# EAGLE design vr01-revA (EAGLE 9.6.2)
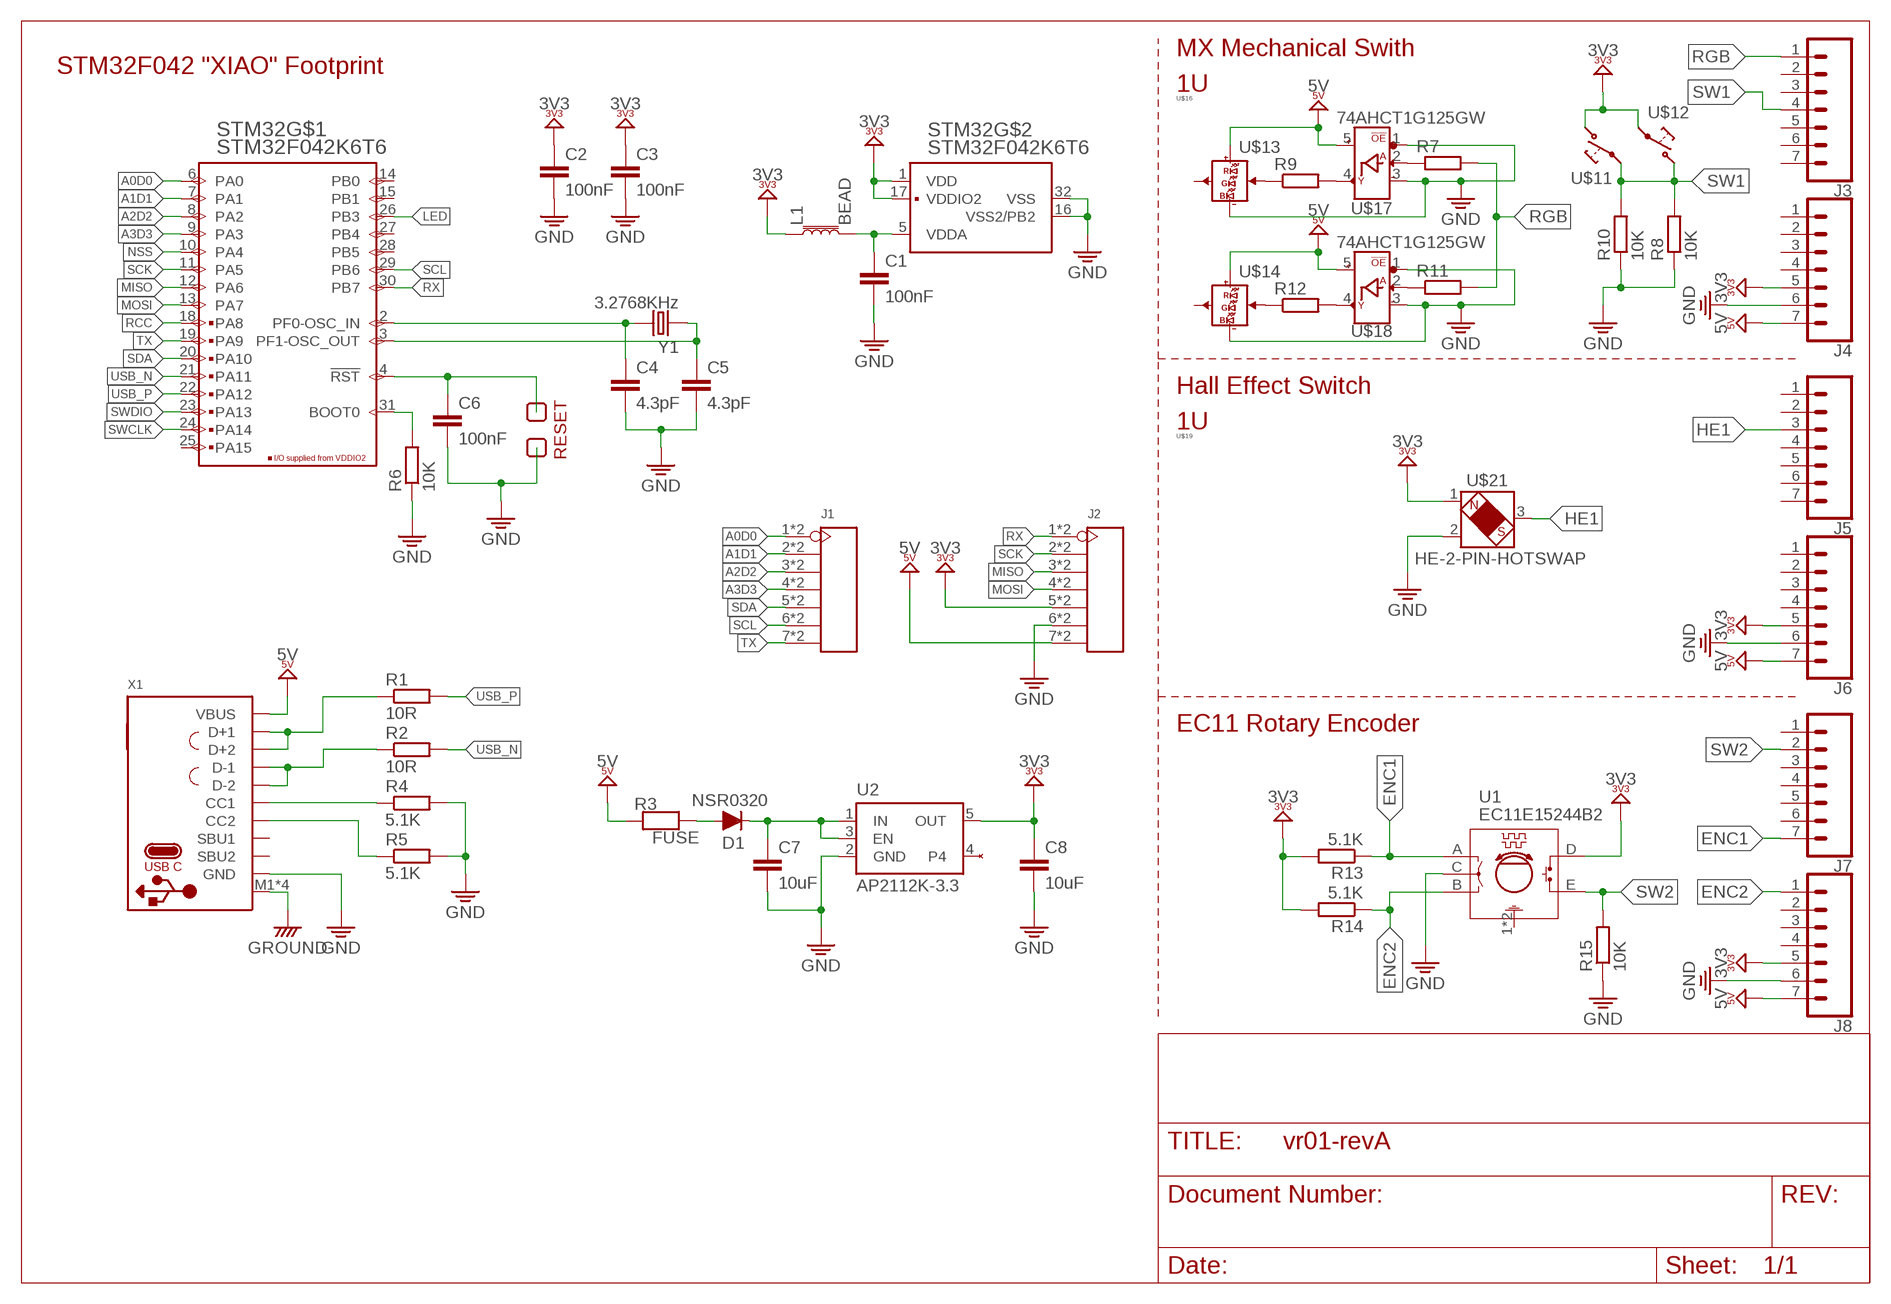
[diagram p0: schematic, sheet 1]

## Parts
C1  100nF  C-EUC0402K  [C0402K]
C2  100nF  C-EUC0402K  [C0402K]
C3  100nF  C-EUC0402K  [C0402K]
C4  4.3pF  C-EUC0402K  [C0402K]
C5  4.3pF  C-EUC0402K  [C0402K]
C6  100nF  C-EUC0402K  [C0402K]
C7  10uF  C-EUC0402K  [C0402K]
C8  10uF  C-EUC0402K  [C0402K]
D1  NSR0320  DIODESOD-323F  [SOD-323F]
J1  HEADER-7P-HALF-HOLE-2.54  [H7-HALF-HOLE-2.54]
J2  HEADER-7P-HALF-HOLE-2.54  [H7-HALF-HOLE-2.54]
J3  CONN_07  [1X07]
J4  CONN_07  [1X07]
J5  CONN_07  [1X07]
J6  CONN_07  [1X07]
J7  CONN_07  [1X07]
J8  CONN_07  [1X07]
L1  BEAD  FERRITE_BEAD  [0402]
R1  10R  R-EU_R0402  [R0402]
R2  10R  R-EU_R0402  [R0402]
R3  FUSE  RESISTOR0805_NOOUTLINE  [0805-NO]
R4  5.1K  R-EU_R0402  [R0402]
R5  5.1K  R-EU_R0402  [R0402]
R6  10K  R-EU_R0402  [R0402]
R7  R-EU_R0603  [R0603]
R8  10K  R-EU_R0603  [R0603]
R9  R-EU_R0603  [R0603]
R10  10K  R-EU_R0603  [R0603]
R11  R-EU_R0603  [R0603]
R12  R-EU_R0603  [R0603]
R13  5.1K  R-EU_R0603  [R0603]
R14  5.1K  R-EU_R0603  [R0603]
R15  10K  R-EU_R0603  [R0603]
STM32  STM32F042K6T6  [LQFP-32]
TP1  TEST-POINT.4RN  [PAD.04X.04-RN]
TP2  TEST-POINT.4RN  [PAD.04X.04-RN]
U1  EC11E15244B2  [ROTARY_EC11E]
U2  AP2112K-3.3  VREG_SOT23-5  [SOT23-5]
U$11  MX-5-PIN-HOTSWAP-VIANO-SILK  [MX-5-PIN-HOTSWAP-VIA-NS]
U$12  MX-5-PIN-HOTSWAP-VIANO-SILK  [MX-5-PIN-HOTSWAP-VIA-NS]
U$13  SK6812-MINI-ESK6812MINI-E  [SK6812-E-MILL_V2]
U$14  SK6812-MINI-ESK6812MINI-E  [SK6812-E-MILL_V2]
U$16  MX-FPRINT-100U-DOC  [MX-FPRINT-DOC-100U]
U$17  74AHCT1G125GW  [SOT353]
U$18  74AHCT1G125GW  [SOT353]
U$19  MX-FPRINT-100U-DOC  [MX-FPRINT-DOC-100U]
U$21  HE-2-PIN-HOTSWAP  [HE-2-PIN-HOTSWAP-NS]
X1  USB_C  [TYPE-C-31-M-12]
Y1  3.2768KHz  SMD-CRYSTAL-32.768KHZ-12.5PF-20PPM-90K(2P-L2.0X1.2MM)  [X2-SMD-L2.0X1.2X0.55MM]

## Nets
!RST: C6.1 STM32.4(!RST) TP1.1
A0D0: J1.1 J1.13 STM32.6(PA0)
A1D1: J1.2 J1.14 STM32.7(PA1)
A2D2: J1.3 J1.15 STM32.8(PA2)
A3D3: J1.4 J1.16 STM32.9(PA3)
BOOT0: R6.2 STM32.31(BOOT0)
ENC1: J7.7 R13.1 U1.A
ENC2: J8.1 R14.1 U1.B
GND: C1.2 C2.2 C3.2 C4.2 C5.2 C6.2 C7.2 C8.2 J2.6 J2.18 J4.6 J6.6 J8.6 R4.2 R5.2 R6.1 R8.1 R10.1 R15.1 STM32.16(VSS2/PB2) STM32.32(VSS) TP2.1 U1.C U2.2(GND) U$13.3-GND(GND) U$14.3-GND(GND) U$17.1(!OE) U$17.3(3_GND) U$18.1(!OE) U$18.3(3_GND) U$21.2(GND) X1.A1B12-GND(GND) X1.B1A12-GND(GND) X1.M1(SHIELD) X1.M2(SHIELD) X1.M3(SHIELD) X1.M4(SHIELD) ; supply symbol labelled GROUND
HE1: J5.3 U$21.3(OUT)
LED: STM32.26(PB3)
MISO: J2.3 J2.15 STM32.12(PA6)
MOSI: J2.4 J2.16 STM32.13(PA7)
N$1: C1.1 L1.2 STM32.5(VDDA)
N$2: C4.1 STM32.2(PF0-OSC_IN) Y1.2
N$3: C5.1 STM32.3(PF1-OSC_OUT) Y1.1
N$4: R4.1 X1.A5-CC1(CC1)
N$5: R5.1 X1.B5-CC2(CC2)
N$6: C7.1 D1.C U2.1(IN) U2.3(EN)
N$7: D1.A R3.2
N$8: R1.1 X1.A6-DP1(D+1) X1.B6-DP2(D+2)
N$9: R2.1 X1.A7-DN1(D-1) X1.B7-DN2(D-2)
N$10: R9.1 U$13.4-DIN(DIN)
N$11: R9.2 U$17.4(Y_DOUT)
N$12: R12.1 U$14.4-DIN(DIN)
N$13: R12.2 U$18.4(Y_DOUT)
N$14: R11.1 U$18.2(A_DIN)
N$15: R7.1 U$17.2(A_DIN)
NSS: STM32.10(PA4)
RCC: STM32.18(PA8)
RGB: J3.1 R7.2 R11.2
RX: J2.1 J2.13 STM32.30(PB7)
SCK: J2.2 J2.14 STM32.11(PA5)
SCL: J1.6 J1.18 STM32.29(PB6)
SDA: J1.5 J1.17 STM32.20(PA10)
SW1: J3.4 R8.2 R10.2 U$11.2@1 U$11.2@2 U$12.1@1 U$12.1@2
SW2: J7.2 R15.2 U1.E
SWCLK: STM32.24(PA14)
SWDIO: STM32.23(PA13)
TX: J1.7 J1.19 STM32.19(PA9)
USB_N: R2.2 STM32.21(PA11)
USB_P: R1.2 STM32.22(PA12)
VCC3: C2.1 C3.1 C8.1 J2.5 J2.17 J4.5 J6.5 J8.5 L1.1 R13.2 R14.2 STM32.1(VDD) STM32.17(VDDIO2) U1.D U2.5(OUT) U$11.1@1 U$11.1@2 U$12.2@1 U$12.2@2 U$21.1(VDD) ; supply symbol labelled 3V3
VCC5: J2.7 J2.19 J4.7 J6.7 J8.7 R3.1 U$13.1-VDD(VDD) U$14.1-VDD(VDD) U$17.5(5_VCC) U$18.5(5_VCC) X1.A4B9-VBUS(VBUS) X1.B4A9-VBUS(VBUS) ; supply symbol labelled 5V
Unconnected: J3.2 J3.3 J3.5 J3.6 J3.7 J4.1 J4.2 J4.3 J4.4 J5.1 J5.2 J5.4 J5.5 J5.6 J5.7 J6.1 J6.2 J6.3 J6.4 J7.1 J7.3 J7.4 J7.5 J7.6 J8.2 J8.3 J8.4 STM32.14(PB0) STM32.15(PB1) STM32.25(PA15) STM32.27(PB4) STM32.28(PB5) U1.1(GND) U1.2(GND) U2.4 U$13.2-DOUT(DOUT) U$14.2-DOUT(DOUT) X1.A8-SBU1(SBU1) X1.B8-SBU2(SBU2)

## Notes on the sheet
- MX Mechanical Swith
- STM32F042 "XIAO" Footprint
- Hall Effect Switch
- RESET
- EC11 Rotary Encoder

## Library data of the parts
C1-C8 = rcl:C-EU: CAPACITOR, European symbol; SPICEPREFIX: C
D1 = adafruit:DIODE: Diode SMADIODE - SMA Surface Mount Package 20V 1A Schottky Diode Digikey: 641-1014-6-ND DO-1N4148 - Through Hole Small Current Diode SOD-123 20V 1 A (.5mV Vf) Schottky Diode - Digikey: MBRX120TPMSCT-ND SOD-323 10V 570mA (.38mV Vf, 3ns) Schottky Diode - Digikey: ZLLS410CT-ND SOD-523 30V 30mA Schottky Diode (RB751S-40TE61) - Digikey: RB751S-40TE61CT-ND SOT23-R/W - SOT23 Package (R = Solder Paste/Reflow Ovens, W = Hand-Soldering) BAT54Film 40V 300mA - Digikey: 497-7162-1-ND
J1 J2 = Seeeduino-XIAO-footprint-eagle:HEADER-7P-HALF-HOLE
J3-J8 = SparkFun-Connectors:CONN_07: Multi connection point. Often used as Generic Header-pin footprint for 0.1 inch spaced/style header connections On any of the 0.1 inch spaced packages, you can populate with these: Break Away Headers - Straight <https://www.sparkfun.com/products/116> (PRT-00116) Break Away Male Headers - Right Angle <https://www.sparkfun.com/products/553> (PRT-00553) Female Headers <https://www.sparkfun.com/products/115> (PRT-00115) Break Away Headers - Machine Pin <https://www.sparkfun.com/products/117> (PRT-00117) Break Away Female Headers - Swiss Machine Pin <https://www.sparkfun.com/products/743> (PRT-00743) For SCREWTERMINALS and SPRING TERMINALS visit here: Screw Terimnals on SparkFun.com <https://www.sparkfun.com/search/results?term=Screw+Terminals> (5mm/3.5mm/2.54mm spacing) This device is also useful as a general connection point to wire up your design to another part of your project. Our various solder wires solder well into these plated through hole pads. Hook-Up Wire - Assortment (Stranded, 22 AWG) <https://www.sparkfun.com/products/11375> (PRT-11375) Hook-Up Wire - Assortment (Solid Core, 22 AWG) <https://www.sparkfun.com/products/11367> (PRT-11367) View the entire wire category on our website here <https://www.sparkfun.com/categories/141> Special notes: Molex polarized connector foot print use with SKU : PRT-08231 with associated crimp pins and housings. 1MM SMD Version SKU: PRT-10208 NOTES ON THE VARIANTS LOCK and LOCK_LONGPADS... This footprint was designed to help hold the alignment of a through-hole component (i.e. 6-pin header) while soldering it into place. You may notice that each hole has been shifted either up or down by 0.005 of an inch from it's more standard position (which is a perfectly straight line). This slight alteration caused the pins (the squares in the middle) to touch the edges of the holes. Because they are alternating, it causes a "brace" to hold the component in place. 0.005 has proven to be the perfect amount of "off-center" position when using our standard breakaway headers. Although looks a little odd when you look at the bare footprint, once you have a header in there, the alteration is very hard to notice. Also,if you push a header all the way into place, it is covered up entirely on the bottom side.
L1 = SparkFun-Coils:FERRITE_BEAD: Ferrite Bead (blocks, cores, rings, chokes, etc.) Inductor with layers of ferrite used to suppress high frequencies. Often used to isolate high frequency noise. SparkFun Products: IOIO-OTG - V2.2 <https://www.sparkfun.com/products/13613> SparkFun SAMD21 Mini Breakout <https://www.sparkfun.com/products/13664> SparkFun 6 Degrees of Freedom Breakout - LSM6DS3 <https://www.sparkfun.com/products/13339> SparkFun SAMD21 Dev Breakout <https://www.sparkfun.com/products/13672> Lilypad MP3 <https://www.sparkfun.com/products/11013>
R1 R2 R4-R15 = rcl:R-EU_: RESISTOR, European symbol; SPICEPREFIX: R
R3 = microbuilder:RESISTOR: Resistors For new designs, use the packages preceded by an '_' character since they are more reliable: The following footprints should be used on most boards: _0402 - Standard footprint for regular board layouts _0603 - Standard footprint for regular board layouts _0805 - Standard footprint for regular board layouts _1206 - Standard footprint for regular board layouts For extremely tight-pitch boards where space is at a premium, the following 'micro-pitch' footprints can be used (smaller pads, no silkscreen outline, etc.): _0402MP - Micro-pitch footprint for very dense/compact boards _0603MP - Micro-pitch footprint for very dense/compact boards _0805MP - Micro-pitch footprint for very dense/compact boards _1206MP - Micro-pitch footprint for very dense/compact boards
STM32 = vr01-footprints:STM32F042K6T6
TP1 TP2 = tecsmith_keyboards:TEST-POINT
U1 = tecsmith_keyboards:EC11E15244B2; COPYRIGHT: Copyright (C) 2023 Ultra Librarian. All rights reserved.; MANUFACTURER_PART_NUMBER: EC11E15244B2; MFR_NAME: Alps Electric
U2 = adafruit_power:VREG_SOT23-5: SOT23-5 Fixed Voltage Regulators Part Current Out V Out V In V Dropout θJA (°C/W) TJ (°C) Digikey Part No. ADP121 150mA 3.3V 3.4-5.5V 0.09V @ 150mA -- -- ADP121-AUJZ33R7CT-ND ADP121 150mA 3.0V 3.1-5.5V 0.09V @ 150mA -- -- ADP121-AUJZ30R7CT-ND ADP122 300mA 3.3V 3.4-5.5V 0.085V @ 300mA -- -- ADP122AUJZ-3.3-R7CT-ND ADP1712 300mA 3.3V 3.5-5.5V 0.17V @ 300mA -- -- ADP1712AUJZ-3.3-R7TR-ND AP7311 (Low Cost) 150mA 3.3V 3.5-6V 0.15V @ 150mA -- -- AP7311-33WG-7DICT-ND LD39015M18R 150mA 1.8V 1.9V-5.5V 0.08V @ 100mA -- -- 497-6977-1-ND LP2985A-33DBVR 150mA 3.3V 3.3-16V 0.28V @ 150mA 206 150 296-18479-1-ND MCP1824T-3302E/OT 300mA 3.3V 3.5V-6V 0.2V @ 300mA -- -- MCP1824T-3302E/OTCT-ND MIC5205-2.5YM5 TR 150mA 2.5V 2.7-16V 0.165V @ 150mA -- -- 576-1257-2-ND MIC5205-3.0YM5 TR 150mA 3.0V 3.2V-16V 0.165V @ 150mA -- -- 576-1258-2-ND MIC5205-3.3YM5 TR 150mA 3.3V 3.5V-16V 0.165V @ 150mA -- -- 576-1259-2-ND TPS780330220 150mA 3.3V+2.2V 3.6-5.5V 250mV Max -- -- 296-23332-1-ND TDA3663/N1,135 100mA 3.3V 3.5-45V 0.18V @ 50mA -- -- 568-5343-1-ND Max operating temp can be calculated using θJA, TJ (max junction temperature), and power in watts. Set the "Maximum Ambient Temperature" until it reaches TJ ("Max Junction Temperature"), which is the absolute limit for safe use of the regulator: Heat Sink Temperature Calculator <http://www.daycounter.com/Calculators/Heat-Sink-Temperature-Calculator.phtml> For example, With 12V source into a 3.3V LP2985 and a 30mA load, we are dissipating (12V-3.3V) * 0.03A = 0.261W. With a θJA of 206 °C/W, a TJ of 150°C, and 261mW we can safely use the chip without a heat sink up to 75°C (=147.1°C Junction Temperature).
U$11 U$12 = tecsmith_keyboards:MX-5-PIN-HOTSWAP-VIA
U$13 U$14 = tecsmith_keyboards:SK6812-MINI-E
U$16 U$19 = tecsmith_keyboards:MX-FPRINT-100U
U$17 U$18 = tecsmith_keyboards:74AHCT1G125GW
U$21 = tecsmith_keyboards:HE-2-PIN-HOTSWAP
X1 = tecsmith_keyboards:USB_C: USB Type-C USB 2.0 Connector
Y1 = OPL_Crystal Oscillator:SMD-CRYSTAL-32.768KHZ-12.5PF-20PPM-90K(2P-L2.0X1.2MM): 306010020; MPN: FC-12M; VALUE: 3.2768KHZ

## Net classes
1 power: width 0.305 mm
2 gnd: width 0.254 mm

## Board
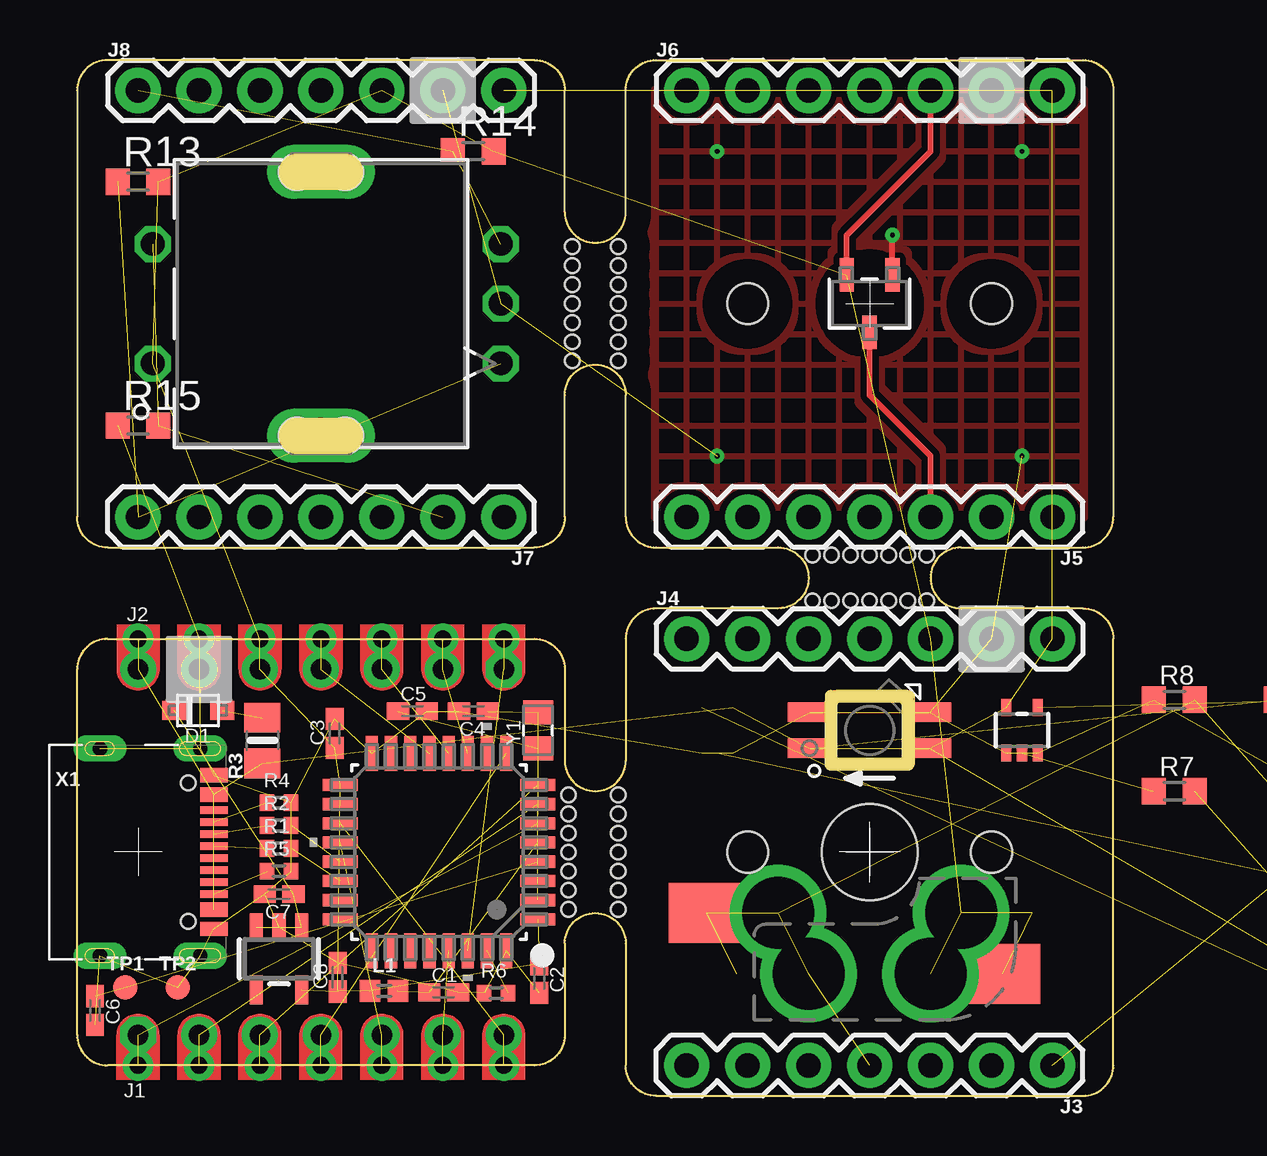
[diagram p1: board, top side]
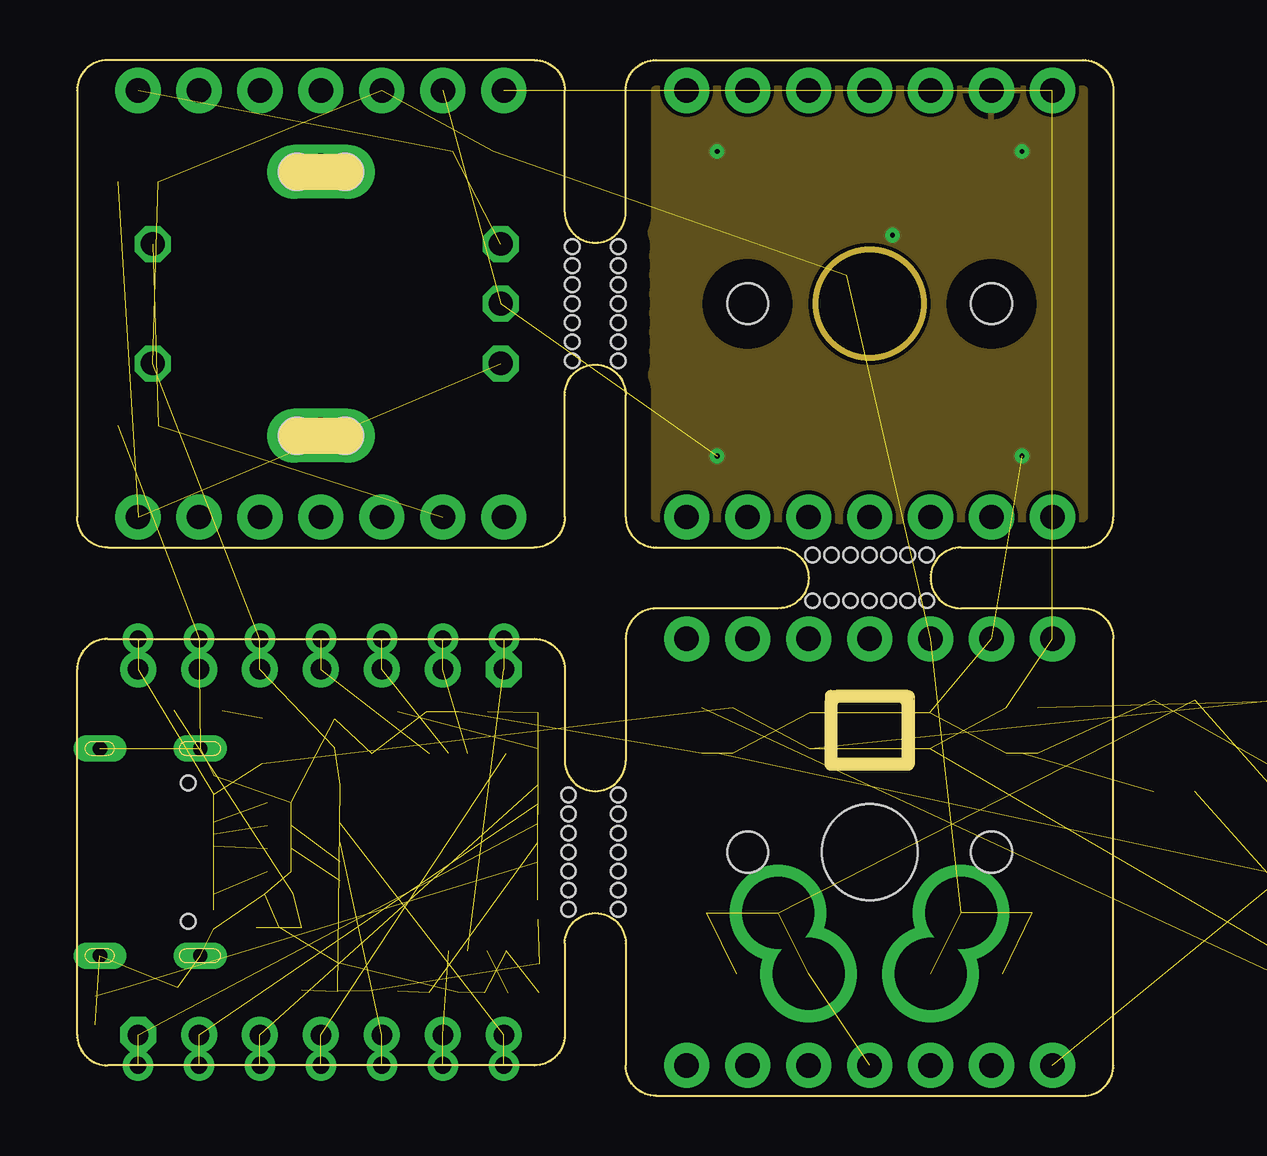
[diagram p2: board, inner layer Route2]
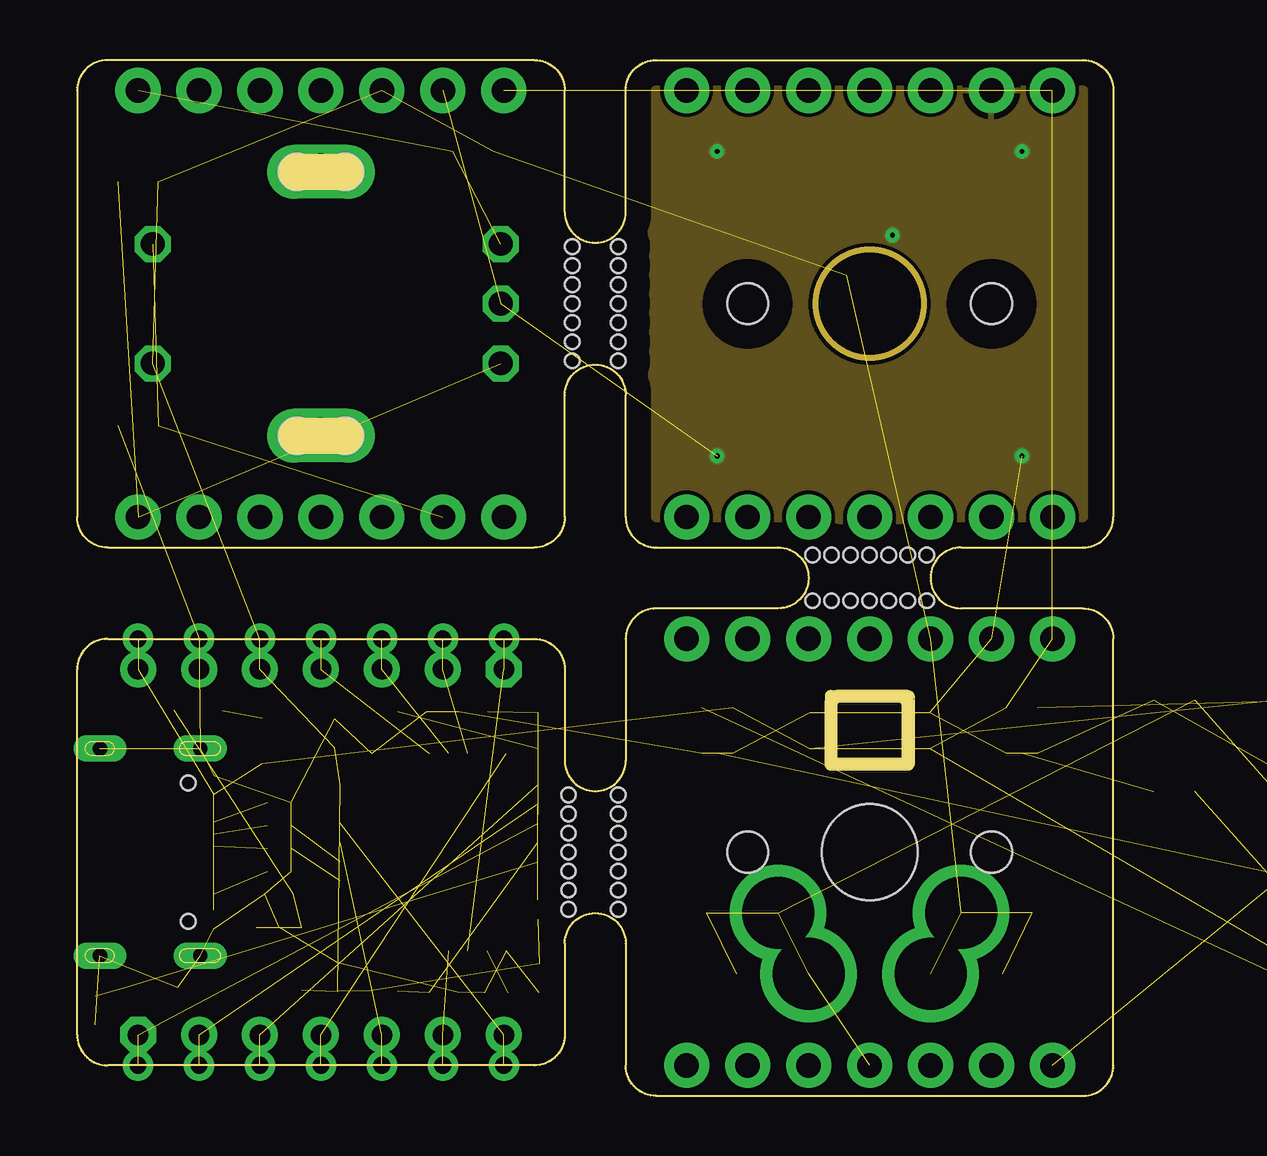
[diagram p3: board, inner layer Route15]
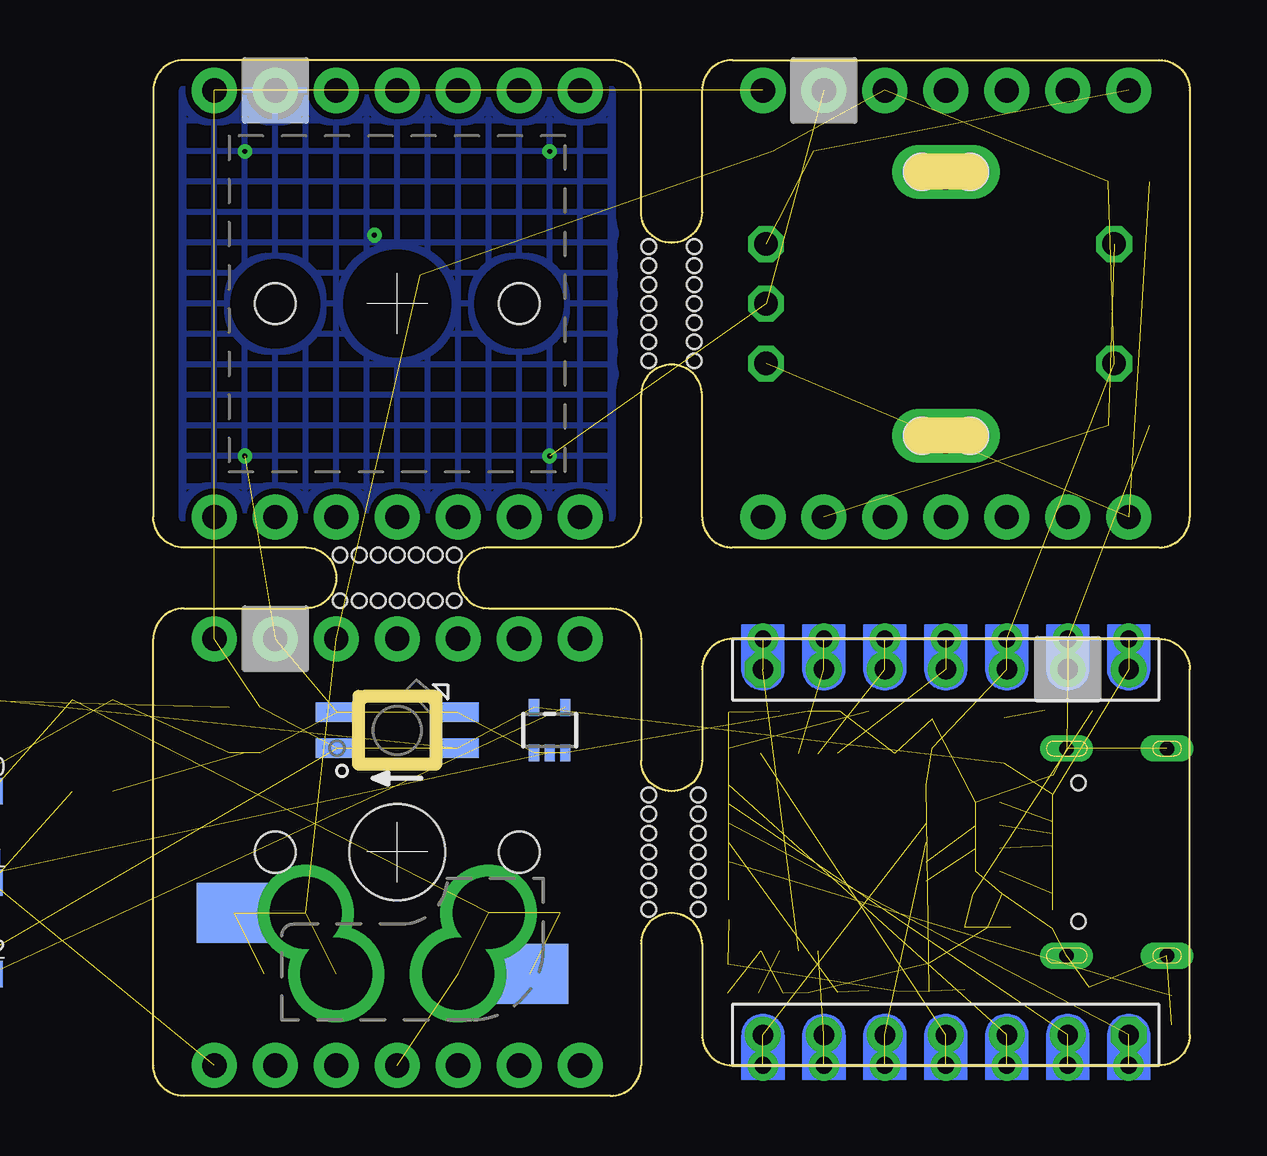
[diagram p4: board, bottom side, seen from below]

Size 43.18 x 43.18 mm. Coordinates in mm from the lower left corner, seen from the top.
Outline: 20.32,17.78 20.32,13.97 arc180 22.86,13.97 22.86,19.05 arc-90 24.13,20.32 29.21,20.32 arc180 29.21,22.86 24.13,22.86 arc-90 22.86,24.13 22.86,29.21 arc180 20.32,29.21 20.32,24.13 arc-90 19.05,22.86 1.27,22.86 arc-90 0,24.13 0,41.91 arc-90 1.27,43.18 19.05,43.18 arc-90 20.32,41.91 20.32,36.83 arc180 22.86,36.83 22.86,41.91 arc-90 24.13,43.18 41.91,43.18 arc-90 43.18,41.91 43.18,24.13 arc-90 41.91,22.86 36.83,22.86 arc180 36.83,20.32 41.91,20.32 arc-90 43.18,19.05 43.18,1.27 arc-90 41.91,0 24.13,0 arc-90 22.86,1.27 22.86,6.35 arc180 20.32,6.35 20.32,2.54 arc-90 19.05,1.27 1.27,1.27 arc-90 0,2.54 0,17.78 arc-90 1.27,19.05 19.05,19.05 arc-90 20.32,17.78
Copper layers (1+2*15+16): Top 0.035mm / dielectric 0.2104mm / Route2 0.0175mm / dielectric 1.065mm / Route15 0.0175mm / dielectric 0.2104mm / Bottom 0.035mm
Design rules "default *": minimum track width 6mil, minimum drill 0.15mm, track to track 6mil, track to pad 6mil, pad to pad 6mil, via to via 12mil, smd to smd 6mil, copper to edge 40mil, drill to drill 6mil, minimum pad ring 10mil, minimum via ring 8mil, stop-mask expansion 4mil, vias tented up to drill 0mil, thermal gap 10mil
Holes 0.6 mm at 20.64,34.61 20.64,33.81 20.64,31.43 20.64,32.23 22.54,35.4 20.64,30.64 22.54,34.61 22.54,33.81 22.54,32.23 22.54,31.43 22.54,30.64 20.64,35.4 30.64,22.54 31.43,22.54 32.23,22.54 33.81,22.54 34.61,22.54 35.4,22.54 30.64,20.64 31.43,20.64 32.23,20.64 33.81,20.64 34.61,20.64 35.4,20.64 20.48,12.54 20.48,11.75 20.48,10.95 20.48,7.78 20.48,8.57 20.48,9.37 22.54,12.54 22.54,11.75 22.54,10.95 22.54,7.78 22.54,8.57 22.54,9.37 20.48,10.16 22.54,10.16 33.02,20.64 33.02,22.54 20.64,33.02 22.54,33.02

### Footprints (pad centres in the part's own frame; a part is rotated, then mirrored left to right if it is on the bottom)
C0402K = smd 0.925 x 0.74: 1 -0.6,0; 2 0.6,0
SOD-323F = smd 1 x 0.8: A -1,0; C 1,0
H7-HALF-HOLE-2.54 = drill 0.85 pad 1.5 octagon: 1 0,7.62 | drill 0.85 pad 1.5: 2 0,5.08; 3 0,2.54; 4 0,0; 5 0,-2.54; 6 0,-5.08; 7 0,-7.62 | drill 0.7 pad 1.27: 13 -1.27,7.62; 14 -1.27,5.08; 15 -1.27,2.54; 16 -1.27,0; 17 -1.27,-2.54; 18 -1.27,-5.08; 19 -1.27,-7.62
1X07 = drill 1.016 pad 1.88: 1 0,0; 2 2.54,0; 3 5.08,0; 4 7.62,0; 5 10.16,0; 6 12.7,0; 7 15.24,0
0402 = smd 0.85 x 0.9: 1 -0.58,0; 2 0.58,0
R0402 = smd 0.6 x 0.7: 1 -0.5,0; 2 0.5,0
0805-NO = smd 1.24 x 1.5: 1 -0.95,0; 2 0.95,0
R0603 = smd 1 x 1.1: 1 -0.85,0; 2 0.85,0
LQFP-32 = smd 1.473 x 0.508: 1 -4.115,2.8; 2 -4.115,2; 3 -4.115,1.2; 4 -4.115,0.4; 5 -4.115,-0.4; 6 -4.115,-1.2; 7 -4.115,-2; 8 -4.115,-2.8; 17 4.115,-2.8; 18 4.115,-2; 19 4.115,-1.2; 20 4.115,-0.4; 21 4.115,0.4; 22 4.115,1.2; 23 4.115,2; 24 4.115,2.8 | smd 0.508 x 1.473: 9 -2.8,-4.115; 10 -2,-4.115; 11 -1.2,-4.115; 12 -0.4,-4.115; 13 0.4,-4.115; 14 1.2,-4.115; 15 2,-4.115; 16 2.8,-4.115; 25 2.8,4.115; 26 2,4.115; 27 1.2,4.115; 28 0.4,4.115; 29 -0.4,4.115; 30 -1.2,4.115; 31 -2,4.115; 32 -2.8,4.115
PAD.04X.04-RN = smd 1.016 x 1.016: 1 0,0
ROTARY_EC11E = drill 1.5 pad 2 long: 1 -5.5,0; 2 5.5,0 | drill 0.991 pad 1.499 octagon: A -2.489,-7.493; B 2.489,-7.493; C 0,-7.493; D -2.489,7.01; E 2.489,7.01 | hole 1.5: -5.5,1; -5.5,-1; 5.5,1; 5.5,-1
SOT23-5 = smd 0.55 x 1.2: 1 -0.95,-1.3; 2 0,-1.3; 3 0.95,-1.3; 4 0.95,1.3; 5 -0.95,1.3
MX-5-PIN-HOTSWAP-VIA-NS = smd 3.15 x 2.5 bottom: 1@1 -6.785,2.54; 2@1 5.542,5.08 | drill 3 pad 3.75: 1@2 -3.81,2.54; 2@2 2.54,5.08 | hole 3.988: 0,0 | hole 1.7: -5.08,0; 5.08,0
SK6812-E-MILL_V2 = smd 1.8 x 0.82 bottom: 1-VDD 2.5,-0.75; 2-DOUT 2.5,0.75; 3-GND -2.5,0.75; 4-DIN -2.5,-0.75
SOT353 = smd 0.42 x 0.7: 1 -0.65,-0.95; 2 0,-0.95; 3 0.65,-0.95; 4 0.65,0.95; 5 -0.65,0.95
HE-2-PIN-HOTSWAP-NS = smd 0.6 x 1.4 bottom: 1 0.953,1.194; 2 -0.953,1.194; 3 0,-1.194 | hole 1.7: -5.08,0; 5.08,0
TYPE-C-31-M-12 = smd 0.6 x 1.14: A1B12-GND -3.2,3.16; A4B9-VBUS -2.4,3.16; B1A12-GND 3.2,3.16; B4A9-VBUS 2.4,3.16 | smd 0.3 x 1.14: A5-CC1 -1.25,3.16; A6-DP1 -0.25,3.16; A7-DN1 0.25,3.16; A8-SBU1 1.25,3.16; B5-CC2 1.75,3.16; B6-DP2 0.75,3.16; B7-DN2 -0.75,3.16; B8-SBU2 -1.75,3.16 | drill 0.6 pad 1 long: M1 -4.32,2.59; M2 4.32,2.59; M3 -4.32,-1.59; M4 4.32,-1.59 | hole 0.6: 2.89,2.09; -2.89,2.09
X2-SMD-L2.0X1.2X0.55MM = smd 1 x 1.25: 1 -0.75,0; 2 0.75,0

### Placement (x,y rotation side)
C1  15.27,4.32 0 top
C2  19.25,4.89 270 top
C3  10.73,15.11 90 top
C4  16.51,16.03 180 top
C5  13.97,16.03 0 top
C6  0.75,3.56 270 top
C7  8.41,8.41 180 top
C8  10.86,4.95 90 top
D1  5.04,16.07 180 top
J1  10.16,2.54 90 top
J2  10.16,17.78 270 top
J3  40.64,1.27 180 top
J4  25.4,19.05 0 top
J5  40.64,24.13 180 top
J6  25.4,41.91 0 top
J7  17.78,24.13 180 top
J8  2.54,41.91 0 top
L1  12.79,4.38 0 top
R1  8.41,10.32 0 top
R2  8.41,11.27 0 top
R3  7.72,14.81 90 top
R4  8.41,12.22 0 top
R5  8.41,9.37 0 top
R6  17.46,4.29 0 top
R7  45.72,12.7 0 top
R8  45.72,16.51 0 top
R9  50.8,16.51 0 top  (outside the outline)
R10  50.8,12.7 0 bottom  (outside the outline)
R11  50.8,8.89 0 bottom  (outside the outline)
R12  50.8,5.08 0 bottom  (outside the outline)
R13  2.54,38.1 0 top
R14  16.51,39.37 0 top
R15  2.54,27.94 0 top
STM32  15.08,10.16 180 top
TP1  2,4.52 0 top
TP2  4.19,4.52 0 top
U1  10.16,33.02 90 top
U2  8.41,5.71 180 top
U$11  33.02,10.16 180 top
U$12  33.02,10.16 180 bottom
U$13  33.02,15.24 0 top
U$14  33.02,15.24 0 bottom
U$16  33.02,10.16 0 top
U$17  39.37,15.24 0 top
U$18  26.67,15.24 0 bottom
U$19  33.02,33.02 0 top
U$21  33.02,33.02 0 bottom
X1  2.54,10.16 270 top
Y1  19.21,15.24 90 top

### Tracks (layer width: path | path; a pad name or v marks a point on that pad's centre or on a via)
!RST  (2 unrouted)
A0D0  (2 unrouted)
A1D1  (2 unrouted)
A2D2  (2 unrouted)
A3D3  (2 unrouted)
BOOT0  (1 unrouted)
ENC1  (2 unrouted)
ENC2  (2 unrouted)
GND  (via drill 0.2 pad 0.35)  (35 unrouted)
  Top 0.254: U$21.2 v33.97,35.88
  other vias: 26.67,39.37 39.37,39.37 39.37,26.67 26.67,26.67
  pour Top (isolate 0.254, hatched): 22.86,41.91 24.13,43.18 41.91,43.18 43.18,41.91 43.18,24.13 41.91,22.86 24.13,22.86 22.86,24.13
  pour Route2: 22.86,41.91 22.86,24.13 24.13,22.86 41.91,22.86 43.18,24.13 43.18,41.91 41.91,43.18 24.13,43.18
  pour Route15: 22.86,41.91 22.86,24.13 24.13,22.86 41.91,22.86 43.18,24.13 43.18,41.91 41.91,43.18 24.13,43.18
  pour Bottom (isolate 0.254, hatched): 22.86,41.91 22.86,24.13 24.13,22.86 41.91,22.86 43.18,24.13 43.18,41.91 41.91,43.18 24.13,43.18
HE1
  Top 0.254: J5.3 35.56,26.67 33.02,29.21 U$21.3
MISO  (2 unrouted)
MOSI  (2 unrouted)
N$1  (2 unrouted)
N$2  (2 unrouted)
N$3  (2 unrouted)
N$4  (1 unrouted)
N$5  (1 unrouted)
N$6  (3 unrouted)
N$7  (1 unrouted)
N$8  (2 unrouted)
N$9  (2 unrouted)
N$10  (1 unrouted)
N$11  (1 unrouted)
N$12  (1 unrouted)
N$13  (1 unrouted)
N$14  (1 unrouted)
N$15  (1 unrouted)
RGB  (2 unrouted)
RX  (2 unrouted)
SCK  (2 unrouted)
SCL  (2 unrouted)
SDA  (2 unrouted)
SW1  (6 unrouted)
SW2  (2 unrouted)
TX  (2 unrouted)
USB_N  (1 unrouted)
USB_P  (1 unrouted)
VCC3  (18 unrouted)
  Top 0.254: U$21.1 32.07,35.88 35.56,39.37 J6.5
VCC5  (11 unrouted)
(copper drawn outside any net)
  shapes: Route15 circle x1, Route2 circle x1